# EAGLE schematic rel-reset (EAGLE 9.6.2)
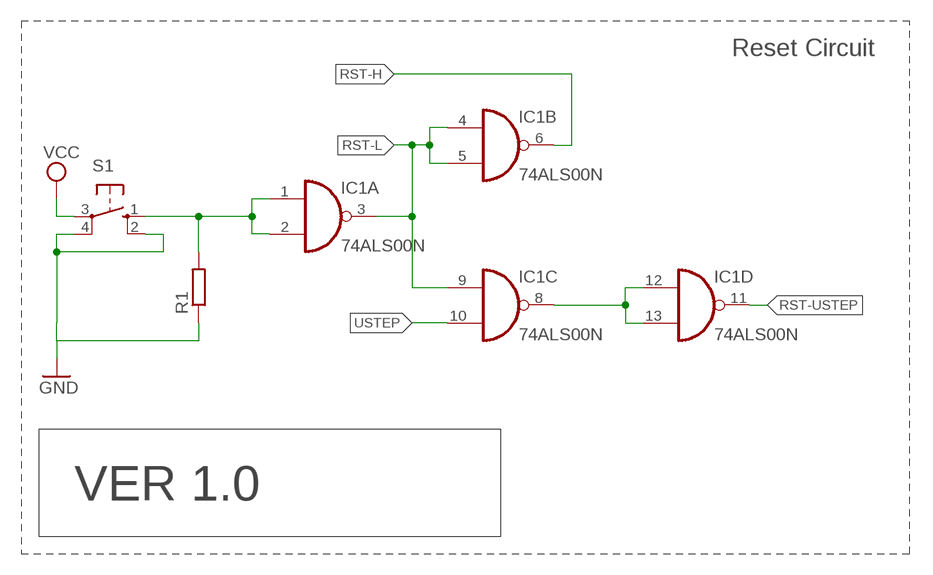
[diagram p0: schematic, sheet 1]

## Parts
IC1  74ALS00N  [DIL14]
R1  R-EU_0204/5  [0204/5]
S1  10-XX  [B3F-10XX]

## Nets
GND: R1.1 S1.2(S1) S1.4(P1)
N$1: IC1.1(A:I0) IC1.2(A:I1) R1.2 S1.1(S)
N$4: IC1.8(C:O) IC1.12(D:I0) IC1.13(D:I1)
RST-H: IC1.6(B:O)
RST-L: IC1.3(A:O) IC1.4(B:I0) IC1.5(B:I1) IC1.9(C:I0)
RST-USTEP: IC1.11(D:O)
USTEP: IC1.10(C:I1)
VCC: S1.3(P)

## Notes on the sheet
- Reset Circuit
- VER 1.0

## Power pins joined to a net without a drawn wire
GND: IC1.7(P:GND)
VCC: IC1.14(P:VCC)

## Library data of the parts
IC1 = 74xx-eu:74*00: Quad 2-input NAND gate
R1 = resistor:R-EU_: RESISTOR, European symbol
S1 = switch-omron:10-XX: OMRON SWITCH; MPN: B3F-1000; OC_FARNELL: 176432; OC_NEWARK: 36M3542